# Altium schematic sheet TemplateDATN.SchDoc
size A3; Organization: Altium Limited; Address1: L3, 12a Rodborough Rd; Address2: Frenchs Forest; Address3: NSW; Address4: Australia 2086
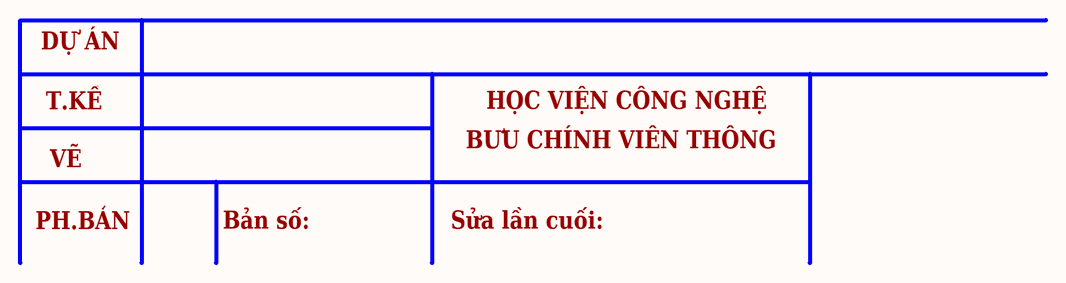
[diagram p0: TemplateDATN.SchDoc]

## Notes on the sheet
- DỰ ÁN
- T.KẾ
- HỌC VIỆN CÔNG NGHỆ
- VẼ
- BƯU CHÍNH VIỄN THÔNG
- PH.BẢN
- Bản số:
- Sửa lần cuối: